# EAGLE design denary-cell-v1 (EAGLE 9.6.1)
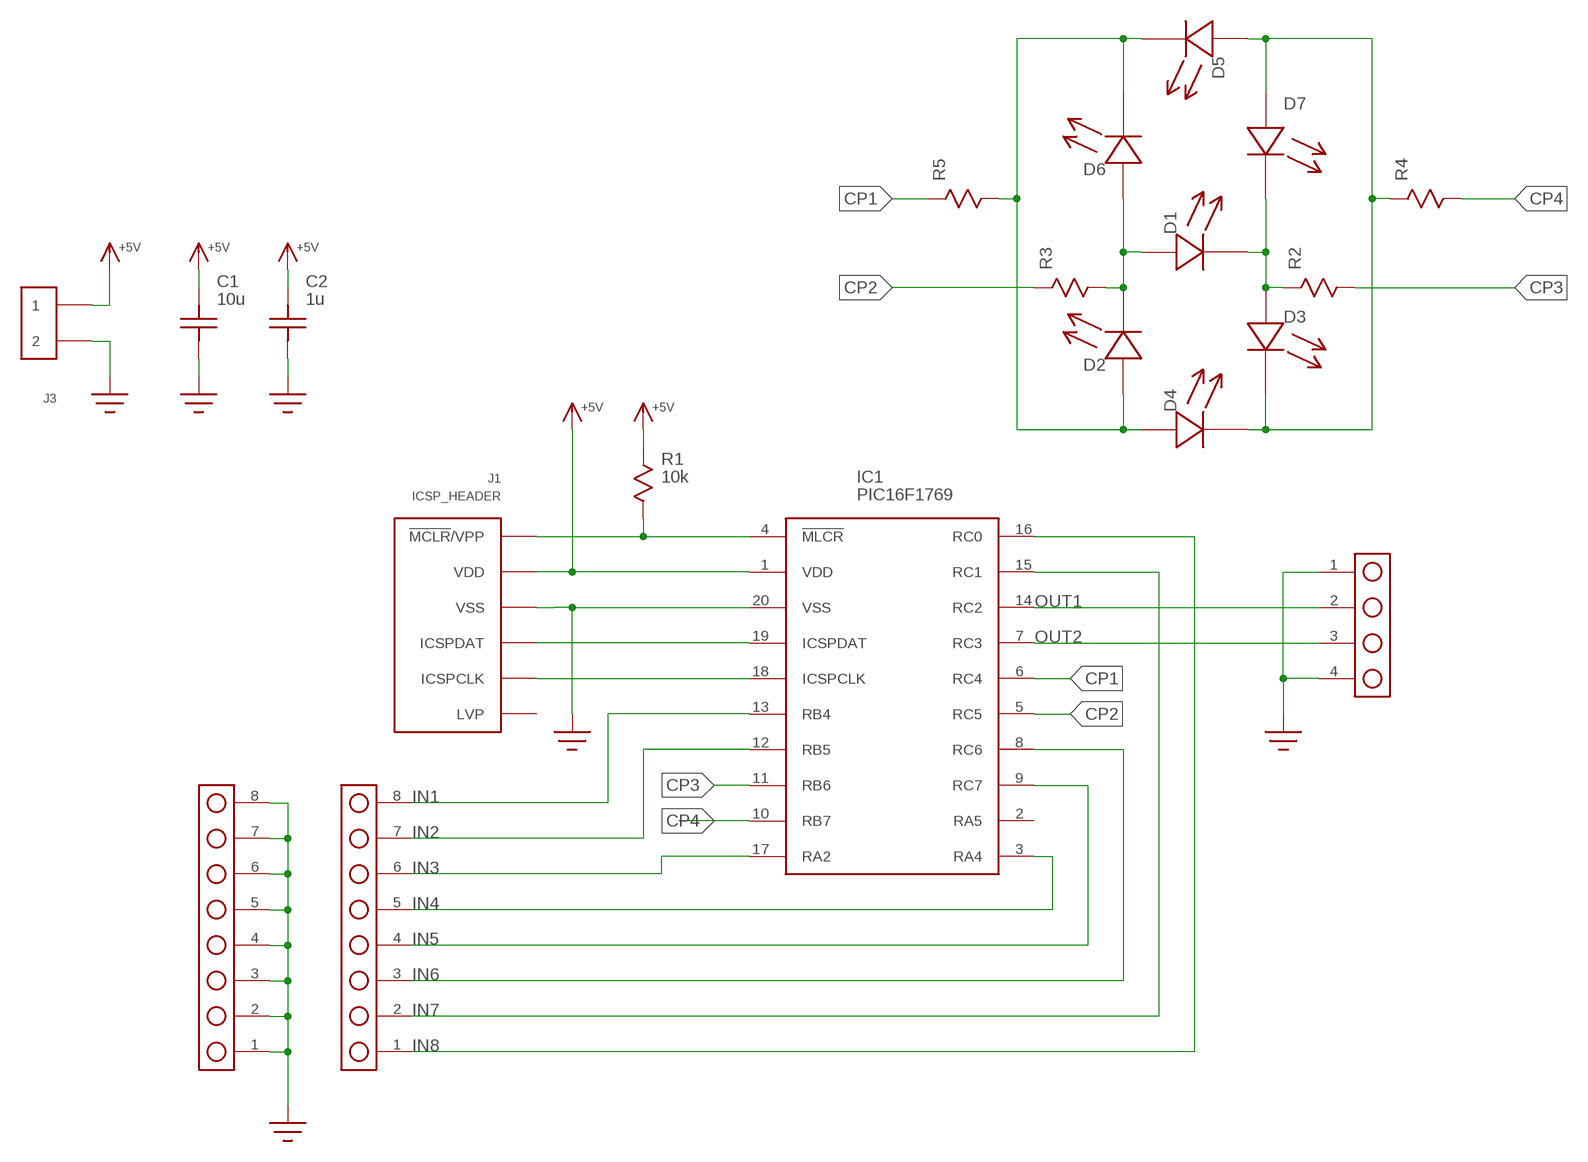
[diagram p0: schematic, sheet 1]

## Parts
C1  10u  C1206  [1206]
C2  1u  C0603  [C0603]
D1  LED  [LED_0603]
D2  LED  [LED_0603]
D3  LED  [LED_0603]
D4  LED  [LED_0603]
D5  LED  [LED_0603]
D6  LED  [LED_0603]
D7  LED  [LED_0603]
IC1  PIC16F1769  [SOIC-20W]
J1  ICSP_HEADER  [HEADER_6PIN]
J2  HEADER_4PIN  [HEADER_4PIN]
J3  HEADER_2PIN  [HEADER_2PIN]
J4  HEADER_8PIN  [HEADER_8_PIN]
J5  HEADER_8PIN  [HEADER_8_PIN]
R1  10k  R0603  [R0603]
R2  R0603  [R0603]
R3  R0603  [R0603]
R4  R0603  [R0603]
R5  R0603  [R0603]

## Nets
+5V: C1.P$2 C2.P$2 IC1.1(VDD) J1.2(VDD) J3.1 R1.P$1
CP1: IC1.6(RC4) R5.P$1
CP2: IC1.5(RC5) R3.P$1
CP3: IC1.11(RB6) R2.P$2
CP4: IC1.10(RB7) R4.P$2
GND: C1.P$1 C2.P$1 IC1.20(VSS) J1.3(VSS) J2.1 J2.4 J3.2 J5.1 J5.2 J5.3 J5.4 J5.5 J5.6 J5.7 J5.8
IN1: IC1.13(RB4) J4.8
IN2: IC1.12(RB5) J4.7
IN3: IC1.17(RA2) J4.6
IN4: IC1.3(RA4) J4.5
IN5: IC1.9(RC7) J4.4
IN6: IC1.8(RC6) J4.3
IN7: IC1.15(RC1) J4.2
IN8: IC1.16(RC0) J4.1
N$1: IC1.4(!MLCR!) J1.1(!MCLR!/VPP) R1.P$2
N$2: D2.A D4.A D5.C D6.C R5.P$2
N$4: IC1.19(ICSPDAT) J1.4(ICSPDAT)
N$5: IC1.18(ICSPCLK) J1.5(ICSPCLK)
N$14: D1.A D2.C D6.A R3.P$2
N$15: D1.C D3.A D7.C R2.P$1
N$17: D3.C D4.C D5.A D7.A R4.P$1
OUT1: IC1.14(RC2) J2.2
OUT2: IC1.7(RC3) J2.3
Unconnected: IC1.2(RA5) J1.6(LVP)

## Library data of the parts
C1 C2 = yapo:C
D1-D7 = yapo:LED
IC1 = yapo:PIC16F1769
J1 = yapo:ICSP_HEADER
J2 = yapo:HEADER_4PIN
J3 = yapo:HEADER_2PIN
J4 J5 = yapo:HEADER_8PIN
R1-R5 = yapo:R

## Board
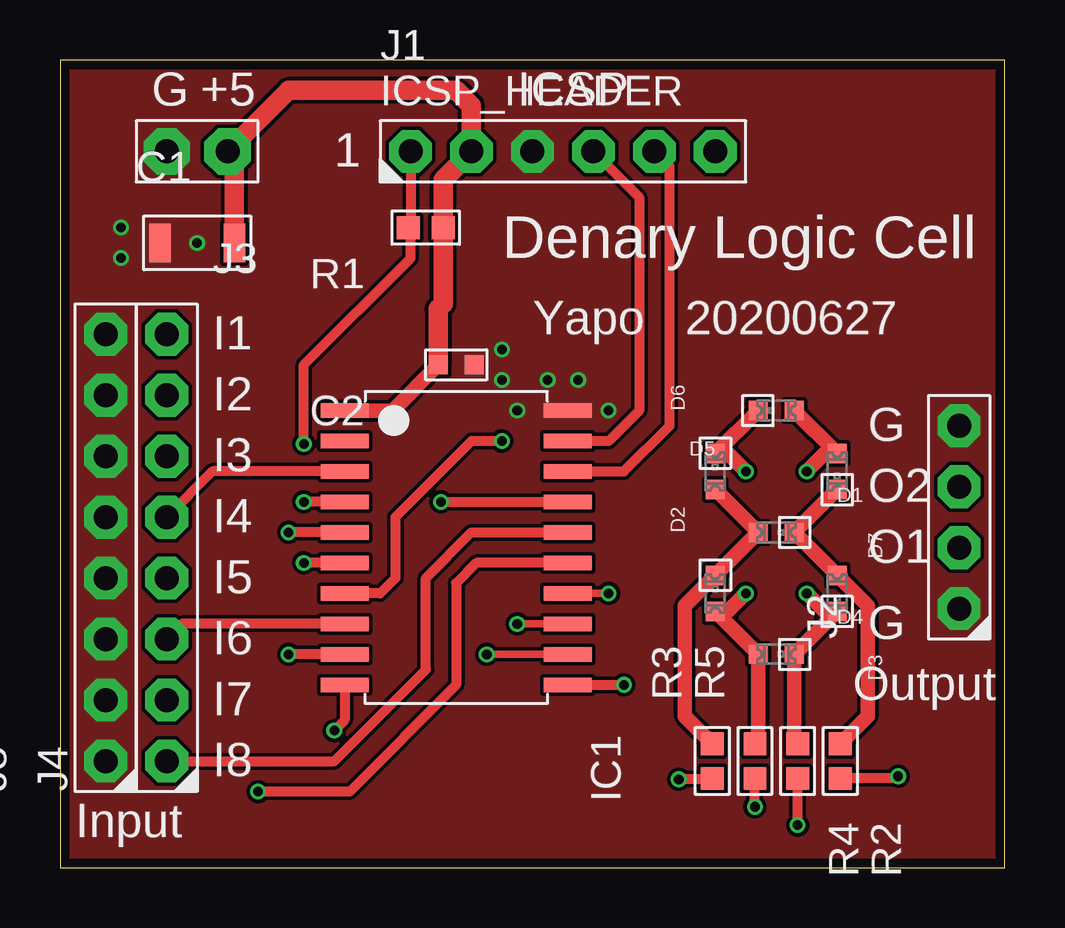
[diagram p1: board, top side]
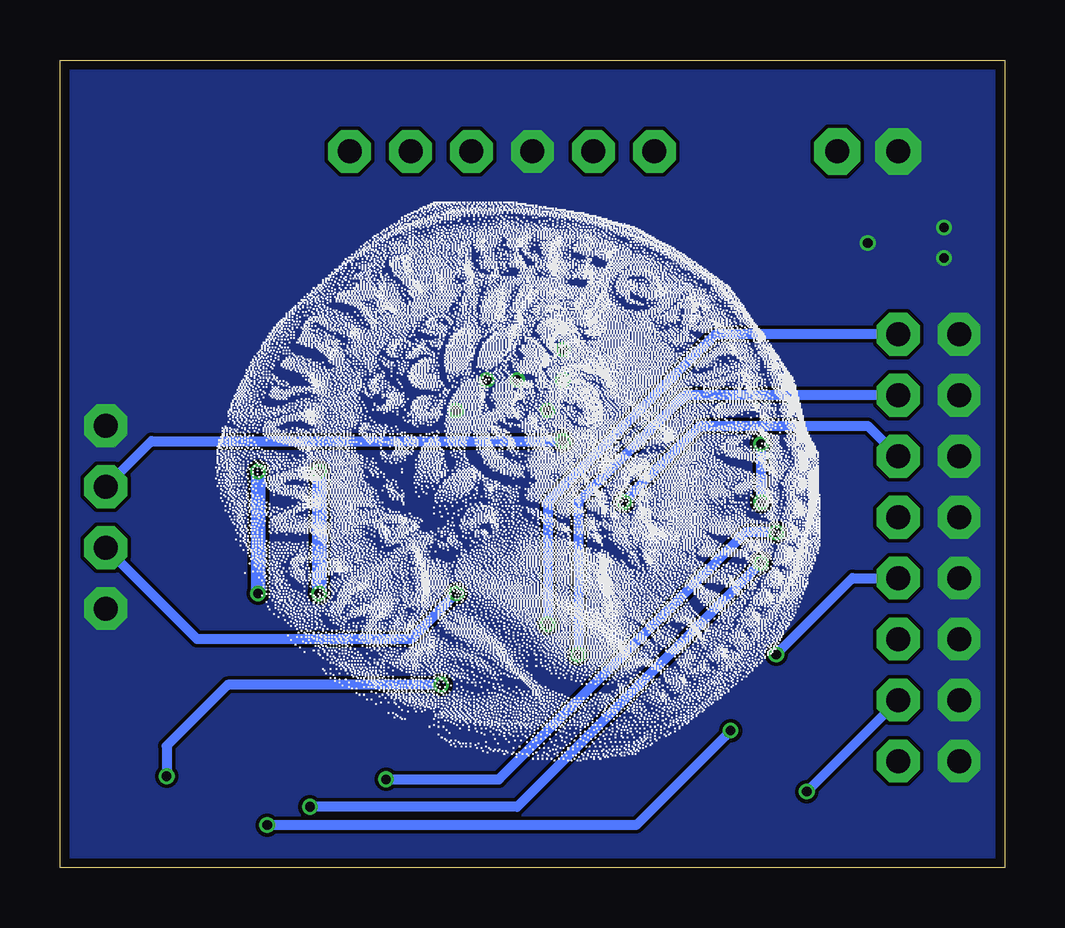
[diagram p2: board, bottom side, seen from below]

Size 39.37 x 33.66 mm. Coordinates in mm from the lower left corner, seen from the top.
Outline: 0,0 39.37,0 39.37,33.66 0,33.66 0,0
Copper layers (1*16): Top 0.035559375mm / dielectric 1.6mm / Bottom 0.035559375mm
Design rules "oshpark-2layer *": minimum track width 6mil, minimum drill 10mil, track to track 6mil, track to pad 6mil, pad to pad 6mil, via to via 6mil, smd to smd 6mil, copper to edge 15mil, drill to drill 6mil, minimum pad ring 5mil, minimum via ring 5mil, stop-mask expansion 2.5mil, vias tented up to drill 20mil, thermal gap 10mil

### Footprints (pad centres in the part's own frame; a part is rotated, then mirrored left to right if it is on the bottom)
1206 = smd 0.9 x 1.6: P$1 -1.55,0; P$2 1.55,0
C0603 = smd 0.8 x 0.8: P$1 -0.75,0; P$2 0.75,0
LED_0603 = smd 0.8 x 0.8: A -0.75,0; C 0.75,0
SOIC-20W = smd 0.6 x 2: 1 -5.715,-4.65; 2 -4.445,-4.65; 3 -3.175,-4.65; 4 -1.905,-4.65; 5 -0.635,-4.65; 6 0.635,-4.65; 7 1.905,-4.65; 8 3.175,-4.65; 9 4.445,-4.65; 10 5.715,-4.65; 11 5.715,4.65; 12 4.445,4.65; 13 3.175,4.65; 14 1.905,4.65; 15 0.635,4.65; 16 -0.635,4.65; 17 -1.905,4.65; 18 -3.175,4.65; 19 -4.445,4.65; 20 -5.715,4.65
HEADER_6PIN = drill 1 pad 1.778 octagon: 1 -6.35,0; 2 -3.81,0; 3 -1.27,0; 4 1.27,0; 5 3.81,0; 6 6.35,0
HEADER_4PIN = drill 1 pad 1.778 octagon: 1 -3.81,0; 2 -1.27,0; 3 1.27,0; 4 3.81,0
HEADER_2PIN = drill 1 pad 1.93 octagon: 1 -1.27,0; 2 1.27,0
HEADER_8_PIN = drill 1 pad 1.778 octagon: 1 -8.89,0; 2 -6.35,0; 3 -3.81,0; 4 -1.27,0; 5 1.27,0; 6 3.81,0; 7 6.35,0; 8 8.89,0
R0603 = smd 0.95 x 0.95: P$1 -0.725,0; P$2 0.725,0

### Placement (x,y rotation side)
C1  5.71,26.04 0 top
C2  16.51,20.95 180 top
D1  29.84,13.97 0 top
D2  27.3,11.43 90 top
D3  32.38,11.43 270 top
D4  29.84,8.89 0 top
D5  29.84,19.05 180 top
D6  27.3,16.51 90 top
D7  32.38,16.51 270 top
IC1  16.51,13.34 270 top
J1  20.95,29.84 0 top
J2  37.47,14.61 90 top
J3  5.71,29.84 180 top
J4  4.45,13.34 90 top
J5  1.91,13.34 90 top
R1  15.24,26.67 180 top
R2  32.51,4.45 270 top
R3  27.18,4.45 90 top
R4  30.73,4.45 270 top
R5  28.96,4.45 90 top

### Tracks (layer width: path | path; a pad name or v marks a point on that pad's centre or on a via)
+5V
  Top 0.61: IC1.1 13.86,19.05 C2.P$2
  Top 0.813: C1.P$2 7.26,29.57 J3.1 9.53,32.38 16.51,32.38 17.14,31.75 J1.2 15.96,28.66 R1.P$1 15.96,23.5 15.76,23.29 C2.P$2
CP1  (via drill 0.4)
  Top 0.406: IC1.6 v10.16,12.7 | v28.96,2.54 R5.P$1
  Bottom 0.406: v10.16,12.7 20.32,2.54 v28.96,2.54
CP2  (via drill 0.4)
  Top 0.406: IC1.5 v9.53,13.97 | R3.P$1 27.14,3.68 v25.78,3.68
  Bottom 0.406: v9.53,13.97 10.79,13.97 21.08,3.68 v25.78,3.68
CP3  (via drill 0.4)
  Top 0.406: IC1.11 v23.5,7.62 | v34.92,3.81 34.84,3.72 R2.P$2
  Bottom 0.406: v23.5,7.62 32.38,7.62 34.92,5.08 v34.92,3.81
CP4  (via drill 0.4)
  Top 0.406: IC1.10 11.86,6.14 v11.43,5.71 | v30.73,1.78 R4.P$2
  Bottom 0.406: v11.43,5.71 15.37,1.78 v30.73,1.78
GND  (via drill 0.4)
  other vias: 19.05,19.05 18.41,21.59 18.41,20.32 22.86,19.05 20.32,20.32 21.59,20.32 2.54,26.67 2.54,25.4 5.71,26.04
  pour Top (no thermals): -3.17,36.2 41.91,36.2 41.91,-2.54 -3.17,-2.54
  pour Bottom (no thermals): -6.99,39.37 45.72,39.37 45.72,-5.71 -6.99,-5.71
IN1  (via drill 0.4)
  Top 0.305: v19.05,10.16 IC1.13
  Bottom 0.406: J4.8 12.06,22.23 19.05,15.24 v19.05,10.16
IN2  (via drill 0.4)
  Top 0.305: v17.78,8.89 IC1.12
  Bottom 0.406: J4.7 13.34,19.68 17.78,15.24 v17.78,8.89
IN3  (via drill 0.4)
  Top 0.406: v15.88,15.24 IC1.17
  Bottom 0.406: J4.6 5.71,18.41 12.7,18.41 v15.88,15.24
IN4
  Top 0.406: IC1.3 6.35,16.51 J4.5
IN5  (via drill 0.4)
  Top 0.406: IC1.9 v9.53,8.89
  Bottom 0.406: v9.53,8.89 6.35,12.06 J4.4
IN6
  Top 0.406: IC1.8 5.08,10.16 J4.3
IN7  (via drill 0.4)
  Top 0.406: IC1.15 17.35,12.7 16.51,11.86 16.51,7.62 12.06,3.17 v8.26,3.17
  Bottom 0.406: v8.26,3.17 J4.2
IN8
  Top 0.406: J4.1 11.43,4.45 15.24,8.26 15.24,12.06 17.14,13.97 IC1.16
N$1  (via drill 0.4)
  Top 0.406: J1.1 14.61,26.76 | 14.61,26.76 R1.P$2 | IC1.4 v10.16,15.24 | v10.16,17.66 10.16,20.95 14.61,25.4 14.61,26.76
  Bottom 0.406: v10.16,15.24 v10.16,17.66 10.16,17.78
N$2  (via drill 0.4)
  Top 0.61: D5.C D6.C 27.82,17.26 v28.57,16.51 | R5.P$2 29.09,5.31 D4.A D2.A 27.82,10.68 v28.57,11.43
  Bottom 0.61: v28.57,16.51 v28.57,11.43
N$4
  Top 0.406: IC1.19 22.86,17.78 24.13,19.05 24.13,27.94 J1.4
N$5
  Top 0.406: IC1.18 23.5,16.51 25.4,18.41 25.4,29.21 J1.5
N$14
  Top 0.61: D6.A D1.A D2.C 26.04,10.91 26.04,6.31 R3.P$2
N$15
  Top 0.61: D7.C D1.C D3.A 33.66,10.91 33.66,6.31 R2.P$1
N$17  (via drill 0.4)
  Top 0.61: D5.A D7.A 31.86,17.26 v31.11,16.51 | R4.P$1 30.59,5.31 D4.C D3.C 31.86,10.68 v31.11,11.43
  Bottom 0.61: v31.11,16.51 v31.11,11.43
OUT1  (via drill 0.4)
  Top 0.305: IC1.14 v22.86,11.43
  Bottom 0.406: v22.86,11.43 24.77,9.53 33.66,9.53 J2.2
OUT2  (via drill 0.4)
  Top 0.406: v18.41,17.78 17.14,17.78 13.97,14.61 13.97,12.06 13.34,11.43 IC1.7
  Bottom 0.406: J2.3 35.56,17.78 v18.41,17.78

### Text on the board
tPlace: G | +5 | ICSP | 1 | Denary Logic Cell | I1 | Yapo | 20200627 | I2 | G | I3 | O2 | I4 | O1 | I5 | G | I6 | Output | I7 | I8 | Input